# EasyEDA schematic SCH_YDS-Charger-Daughter-Board_2022-05-27.json
TITLE: Sheet_1; REV: 1.0; Date: 2022-03-07; Sheet: 1/1; Drawn By: liaozhelin; Company: Your Company
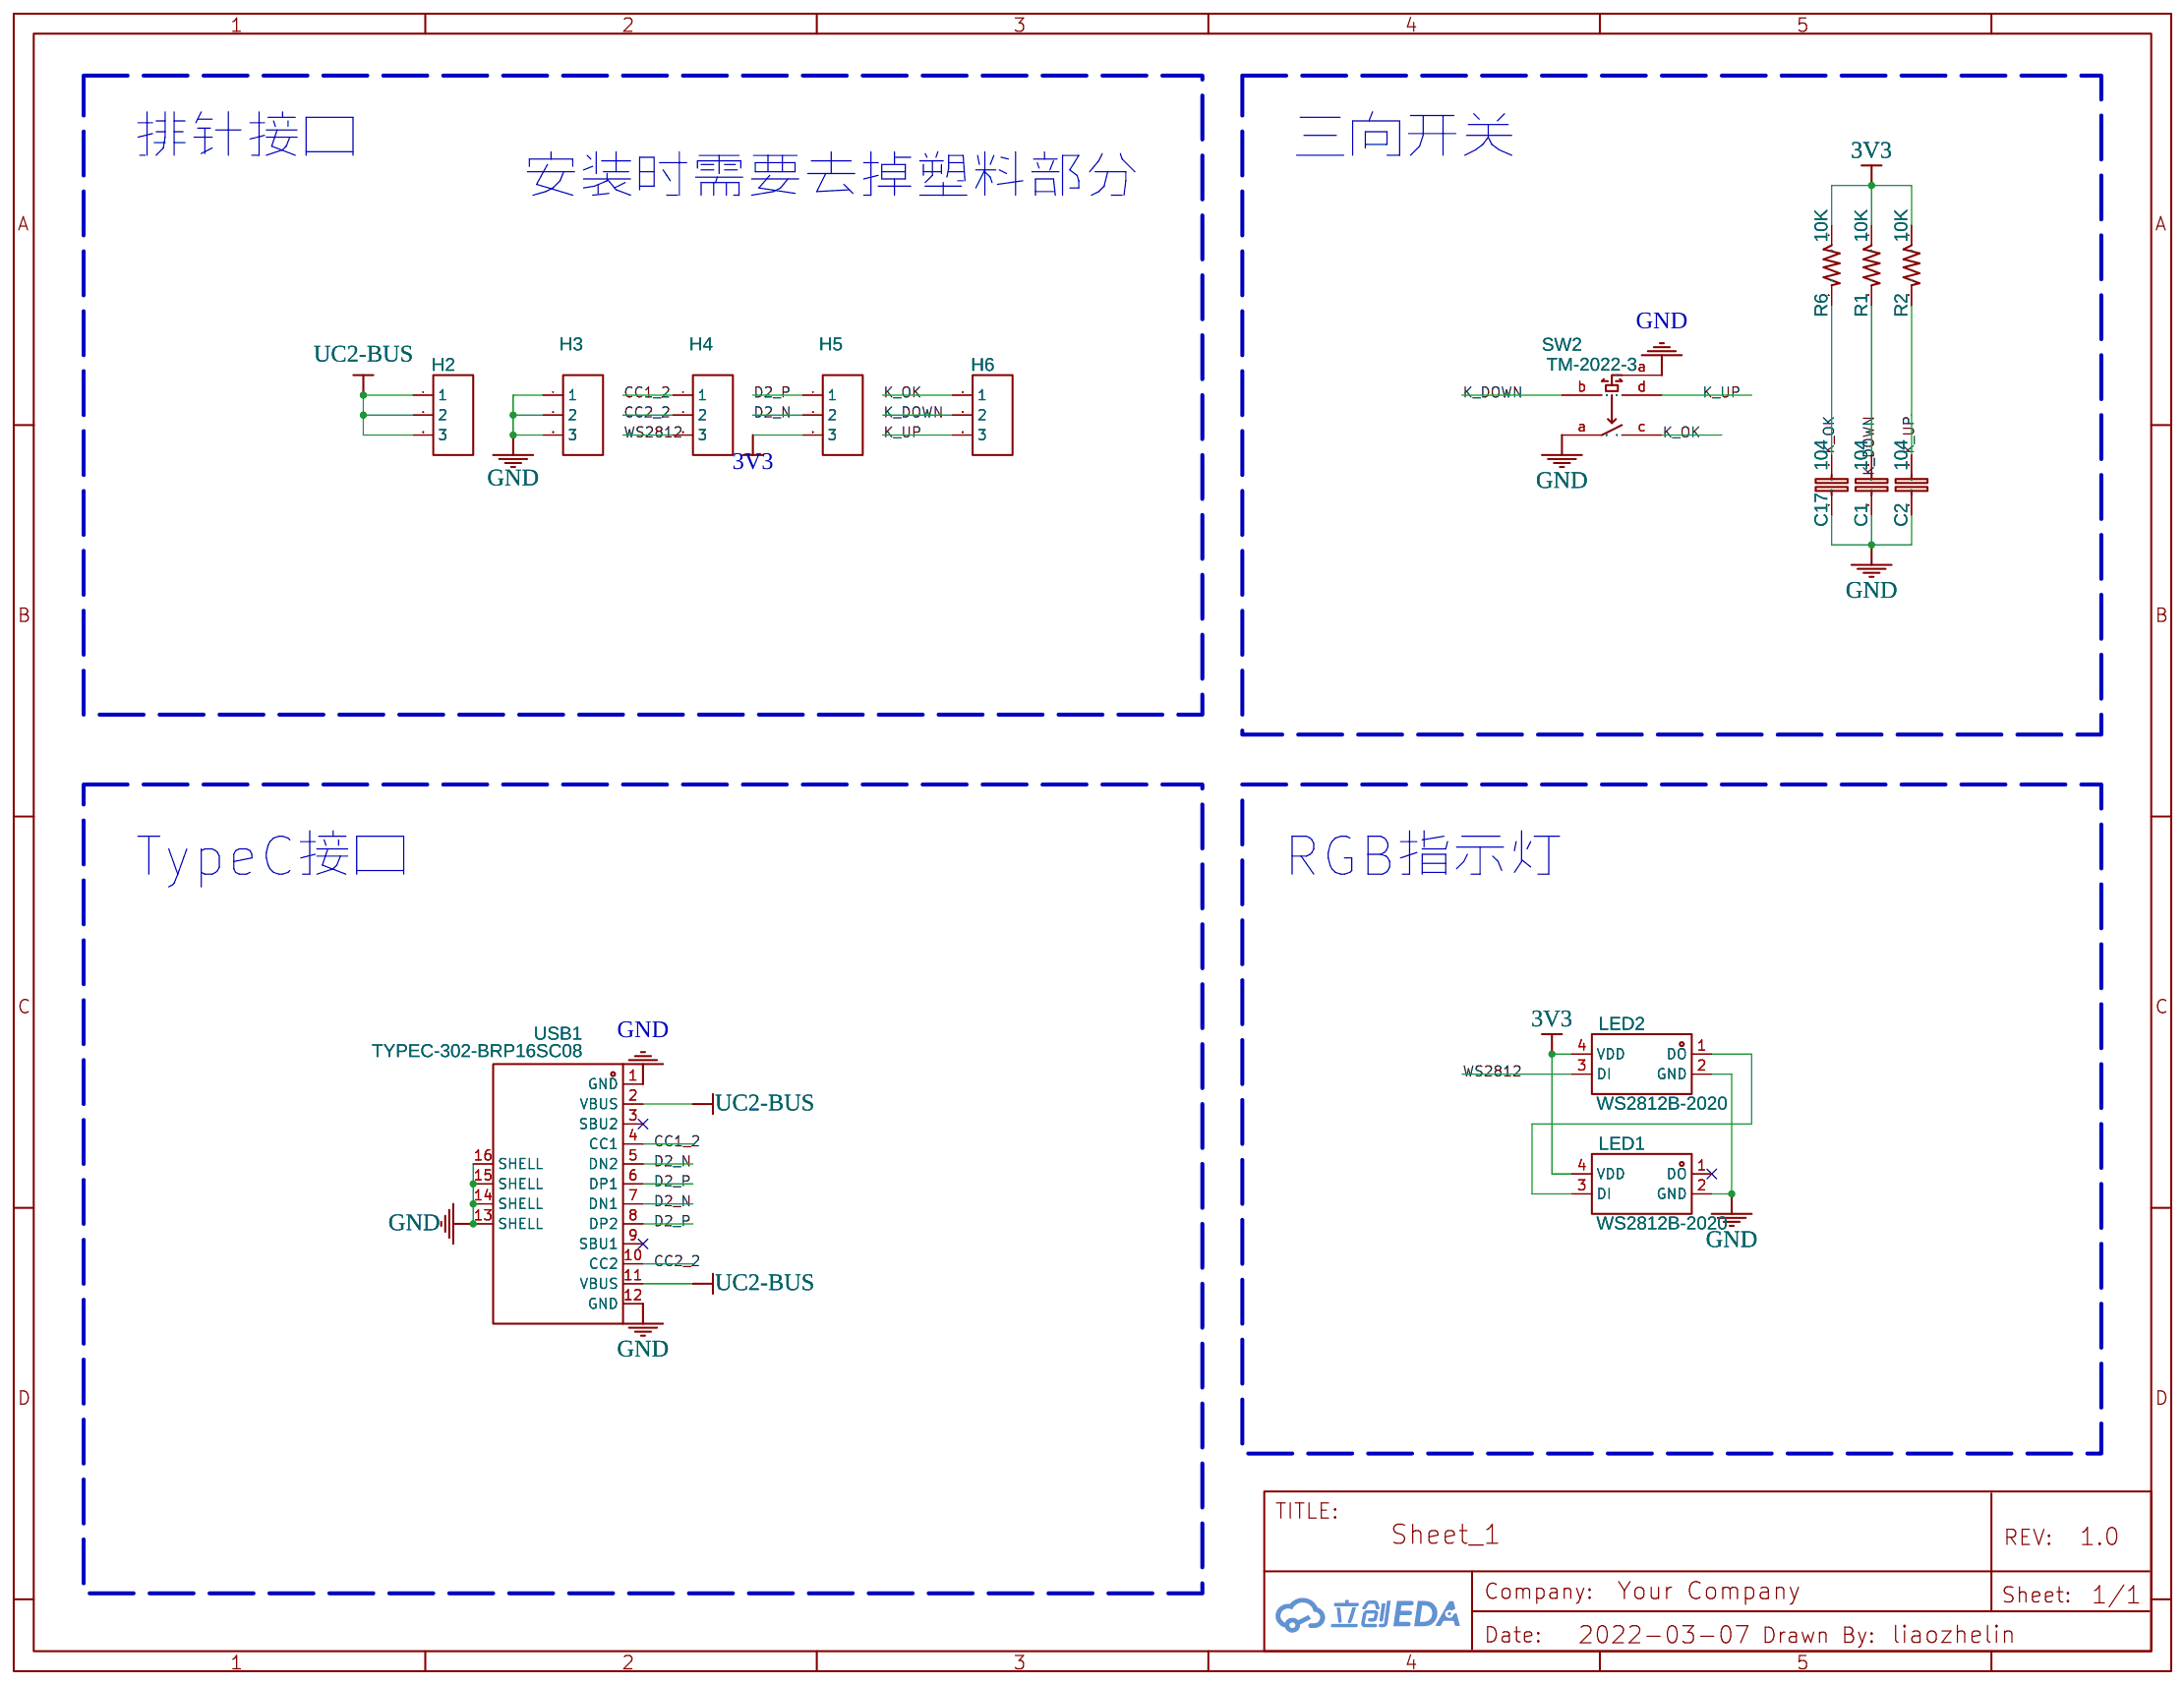
[diagram p0: schematic sheet]

## Parts
C1  104  [C0603]
C2  104  [C0603]
C17  104  [C0603]
H2  HDR-F-2.54_1x3  [HDR-F-2.54_1X3]
H3  HDR-F-2.54_1x3  [HDR-F-2.54_1X3]
H4  HDR-F-2.54_1x3  [HDR-F-2.54_1X3]
H5  HDR-F-2.54_1x3  [HDR-F-2.54_1X3]
H6  HDR-F-2.54_1x3  [HDR-F-2.54_1X3]
LED1  WS2812B-2020  [LED-SMD_4P-L2.0-W2.0-TL_WS2812B-2020]
LED2  WS2812B-2020  [LED-SMD_4P-L2.0-W2.0-TL_WS2812B-2020]
R1  10K  [R0603]
R2  10K  [R0603]
R6  10K  [R0603]
SW2  TM-2022-3  [SW-SMD_TM-2022-3]
USB1  TYPEC-302-BRP16SC08  [USB-C-SMD_TYPEC-302-BRP16SC08]

## Library data of the parts
C1 C2 C17 = 1.0PF-50V(-_+.25PF)(0603): CAP-07879; Contributor: SparkFun
H2-H6 = HDR-F-2.54_1x3: Supplier Part: C146690; Supplier: LCSC; Contributor: LCEDA_Lib
LED1 LED2 = WS2812B-2020: Supplier: LCSC; Supplier Part: C965555; Manufacturer: Worldsemi; Contributor: LCSC; JLCPCB Part Class: Extended Part
R1 R2 R6 = 1.2MOHMS-1_10W-1%(0603): RES-10055; Contributor: SparkFun
SW2 = TM-2022-3: Supplier: LCSC; Supplier Part: C318952; Manufacturer: XKB Enterprise; Contributor: LCSC; JLCPCB Part Class: Extended Part
USB1 = TYPEC-302-BRP16SC08: Supplier: LCSC; Supplier Part: C2835312; Manufacturer: XUNPU(讯普); Contributor: LCSC

## Nets
3V3: H5.3 LED1.4(VDD) LED2.4(VDD) R1.1 R2.1 R6.1
GND: C1.2 C2.2 C17.2 H3.1 H3.2 H3.3 LED1.2(GND) LED2.2(GND) SW2.a USB1.1(GND) USB1.12(GND) USB1.13(SHELL) USB1.14(SHELL) USB1.15(SHELL) USB1.16(SHELL)
CC1_2: H4.1 USB1.4(CC1)
CC2_2: H4.2 USB1.10(CC2)
D2_N: H5.2 USB1.5(DN2) USB1.7(DN1)
D2_P: H5.1 USB1.6(DP1) USB1.8(DP2)
K_DOWN: C1.1 H6.2 R1.2 SW2.b
K_OK: C17.1 H6.1 R6.2 SW2.c
K_UP: C2.1 H6.3 R2.2 SW2.d
UC2-BUS: H2.1 H2.2 H2.3 USB1.2(VBUS) USB1.11(VBUS)
WS2812: H4.3 LED2.3(DI)
Net-(LED1-3): LED1.3(DI) LED2.1(DO)

Not connected (* = marked no-connect by the designer): LED1 1(DO)*; USB1 3(SBU2)* 9(SBU1)*

## Notes on the sheet
- 排针接口
- 三向开关
- 安装时需要去掉塑料部分
- TypeC接口
- RGB指示灯
